# Altium project Isaac MSP430 Subsystem.PrjPcb
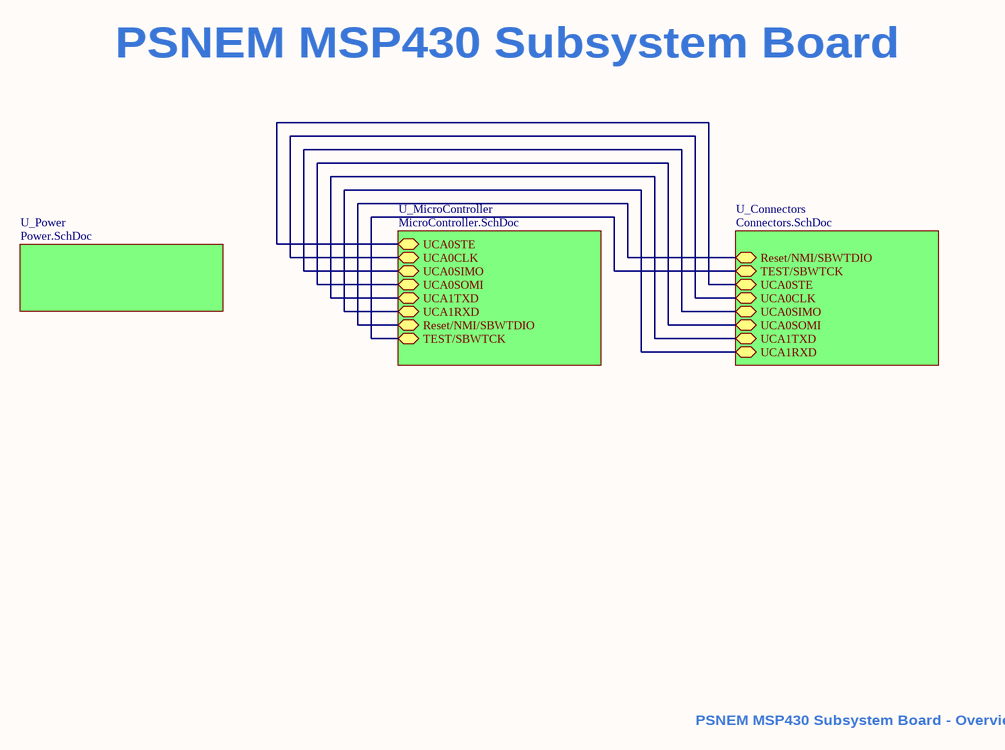
[diagram p0: Overview.SchDoc]
4 sheets, 36 parts. Net scope: hierarchical (ports join the sheet entries above them; power ports are global).
Board file: PSNEM-MCU-Subsystem.PcbDoc
Sheets:
  Overview.SchDoc
    U_Connectors = Connectors.SchDoc
    U_MicroController = MicroController.SchDoc
    U_Power = Power.SchDoc

## Sheet Overview.SchDoc
size A; SheetNumber: 1; SheetTotal: 4

### Sub-sheets
U_Connectors = Connectors.SchDoc: Reset/NMI/SBWTDIO (bidir), TEST/SBWTCK (bidir), UCA0STE (bidir), UCA0CLK (bidir), UCA0SIMO (bidir), UCA0SOMI (bidir), UCA1TXD (bidir), UCA1RXD (bidir)
U_MicroController = MicroController.SchDoc: UCA0STE (bidir), UCA0CLK (bidir), UCA0SIMO (bidir), UCA0SOMI (bidir), UCA1TXD (bidir), UCA1RXD (bidir), Reset/NMI/SBWTDIO (bidir), TEST/SBWTCK (bidir)
U_Power = Power.SchDoc: no entries

### Nets
NetC7_2: sheet U_Connectors/Reset/NMI/SBWTDIO, sheet U_MicroController/Reset/NMI/SBWTDIO
NetJ2_1: sheet U_Connectors/UCA0STE, sheet U_MicroController/UCA0STE
NetJ2_2: sheet U_Connectors/UCA0CLK, sheet U_MicroController/UCA0CLK
NetJ2_3: sheet U_Connectors/UCA0SIMO, sheet U_MicroController/UCA0SIMO
NetJ2_4: sheet U_Connectors/UCA0SOMI, sheet U_MicroController/UCA0SOMI
NetJ3_7: sheet U_Connectors/TEST/SBWTCK, sheet U_MicroController/TEST/SBWTCK
NetJ4_1: sheet U_Connectors/UCA1TXD, sheet U_MicroController/UCA1TXD
NetJ4_3: sheet U_Connectors/UCA1RXD, sheet U_MicroController/UCA1RXD

### Notes on the sheet
- PSNEM MSP430 Subsystem Board
- PSNEM MSP430 Subsystem Board - Overview

## Sheet Connectors.SchDoc
size A4; SheetNumber: 4; SheetTotal: 4
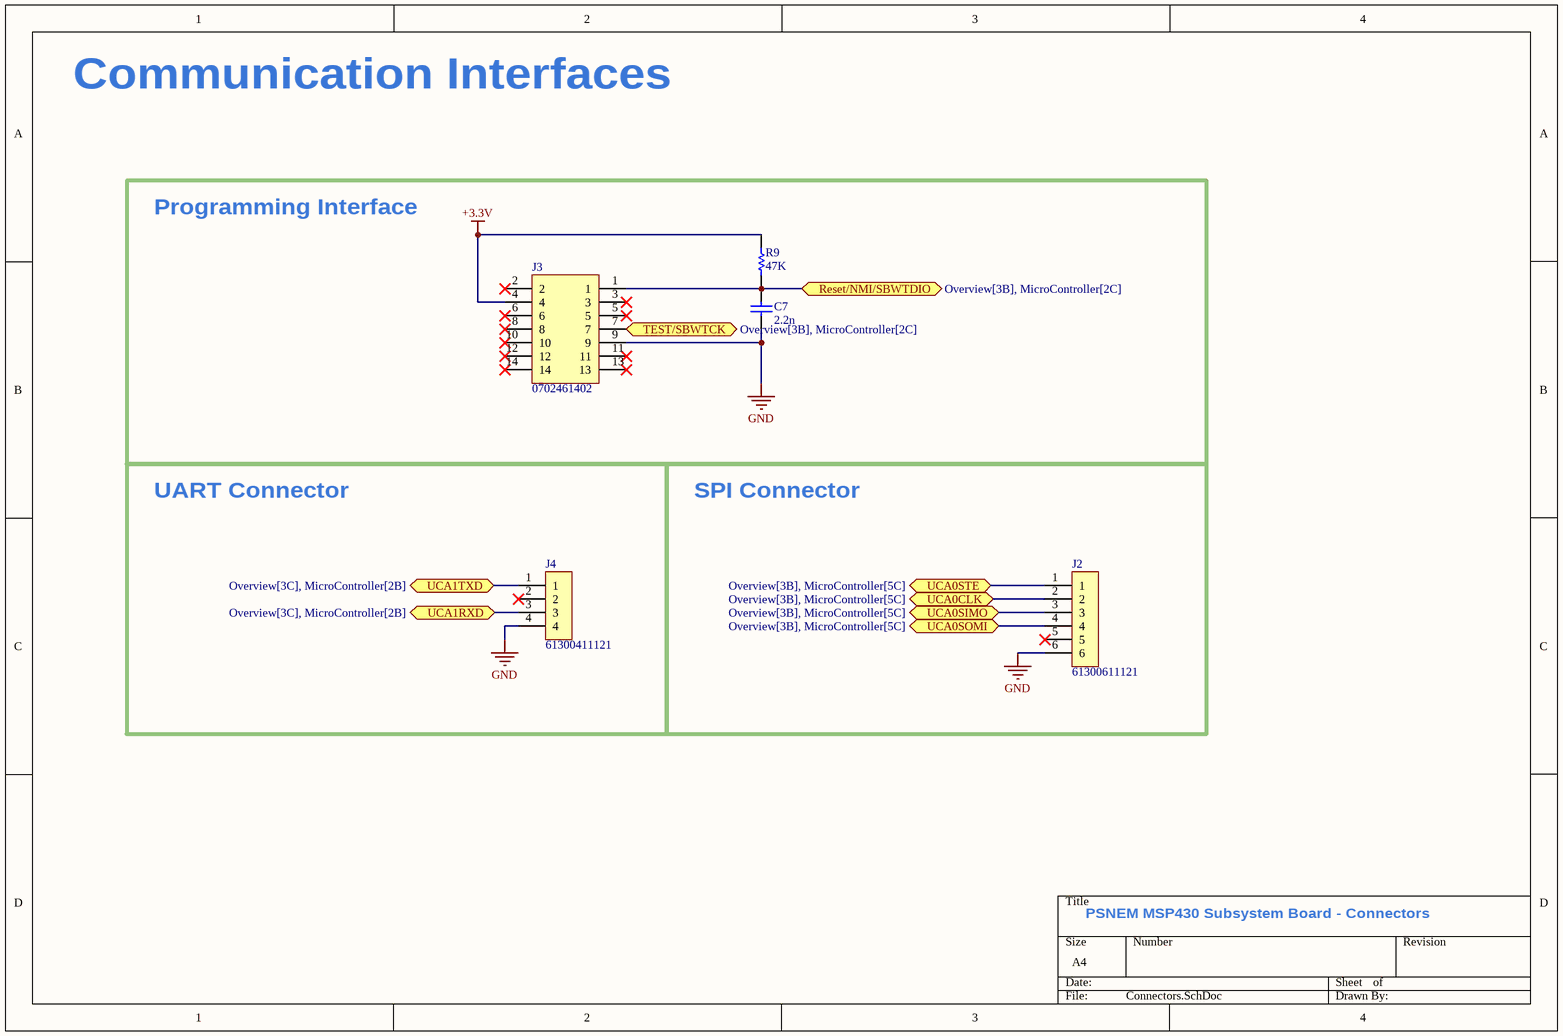
[diagram p1: Connectors.SchDoc]

### Parts
C7  2.2n  [0805 Cap]
J2  61300611121  [61300611121]
J3  0702461402  [0702461402]
J4  61300411121  [61300411121]
R9  47K  [RESC1608X06N]

### Blocks framed on the sheet
Programming Interface: C7 J3 R9
UART Connector: J4
SPI Connector: J2

### Ports
Reset/NMI/SBWTDIO (bidir, see Overview[3B], MicroController[2C]), TEST/SBWTCK (bidir, see Overview[3B], MicroController[2C]), UCA0CLK (bidir, see Overview[3B], MicroController[5C]), UCA0SIMO (bidir, see Overview[3B], MicroController[5C]), UCA0SOMI (bidir, see Overview[3B], MicroController[5C]), UCA0STE (bidir, see Overview[3B], MicroController[5C]), UCA1RXD (bidir, see Overview[3C], MicroController[2B]), UCA1TXD (bidir, see Overview[3C], MicroController[2B])

### Nets
+3.3V: J3.4 R9.2
GND: C7.1 J2.6 J3.9 J4.4
NetC7_2: C7.2 J3.1 R9.1 ; port Reset/NMI/SBWTDIO
NetJ2_1: J2.1 ; port UCA0STE
NetJ2_2: J2.2 ; port UCA0CLK
NetJ2_3: J2.3 ; port UCA0SIMO
NetJ2_4: J2.4 ; port UCA0SOMI
NetJ3_7: J3.7 ; port TEST/SBWTCK
NetJ4_1: J4.1 ; port UCA1TXD
NetJ4_3: J4.3 ; port UCA1RXD

Not connected (* = marked no-connect by the designer): J2 5*; J3 2* 3* 5* 6* 8* 10* 11* 12* 13* 14*; J4 2*

### Notes on the sheet
- Communication Interfaces
- PSNEM MSP430 Subsystem Board - Connectors

### Library data of the parts
C7 = CC0805KRX7R9BB222: 2200 pF ±10% 50V Ceramic Capacitor X7R 0805 (2012 Metric); value: 2.2n
J2 = 61300611121: CONN HEADER VERT 6POS 2.54MM
J3 = 0702461402: Connector Header Through Hole 14 position 0.100" (2.54mm)
J4 = 61300411121: Connector Header Through Hole 4 position 0.100" (2.54mm)
R9 = ERA-3VEB4702V: Thin Film Resistors - SMD 0603 0.1% 47Kohm 25ppm SMD; value: 47K

## Sheet MicroController.SchDoc
size A3; SheetNumber: 3; SheetTotal: 4
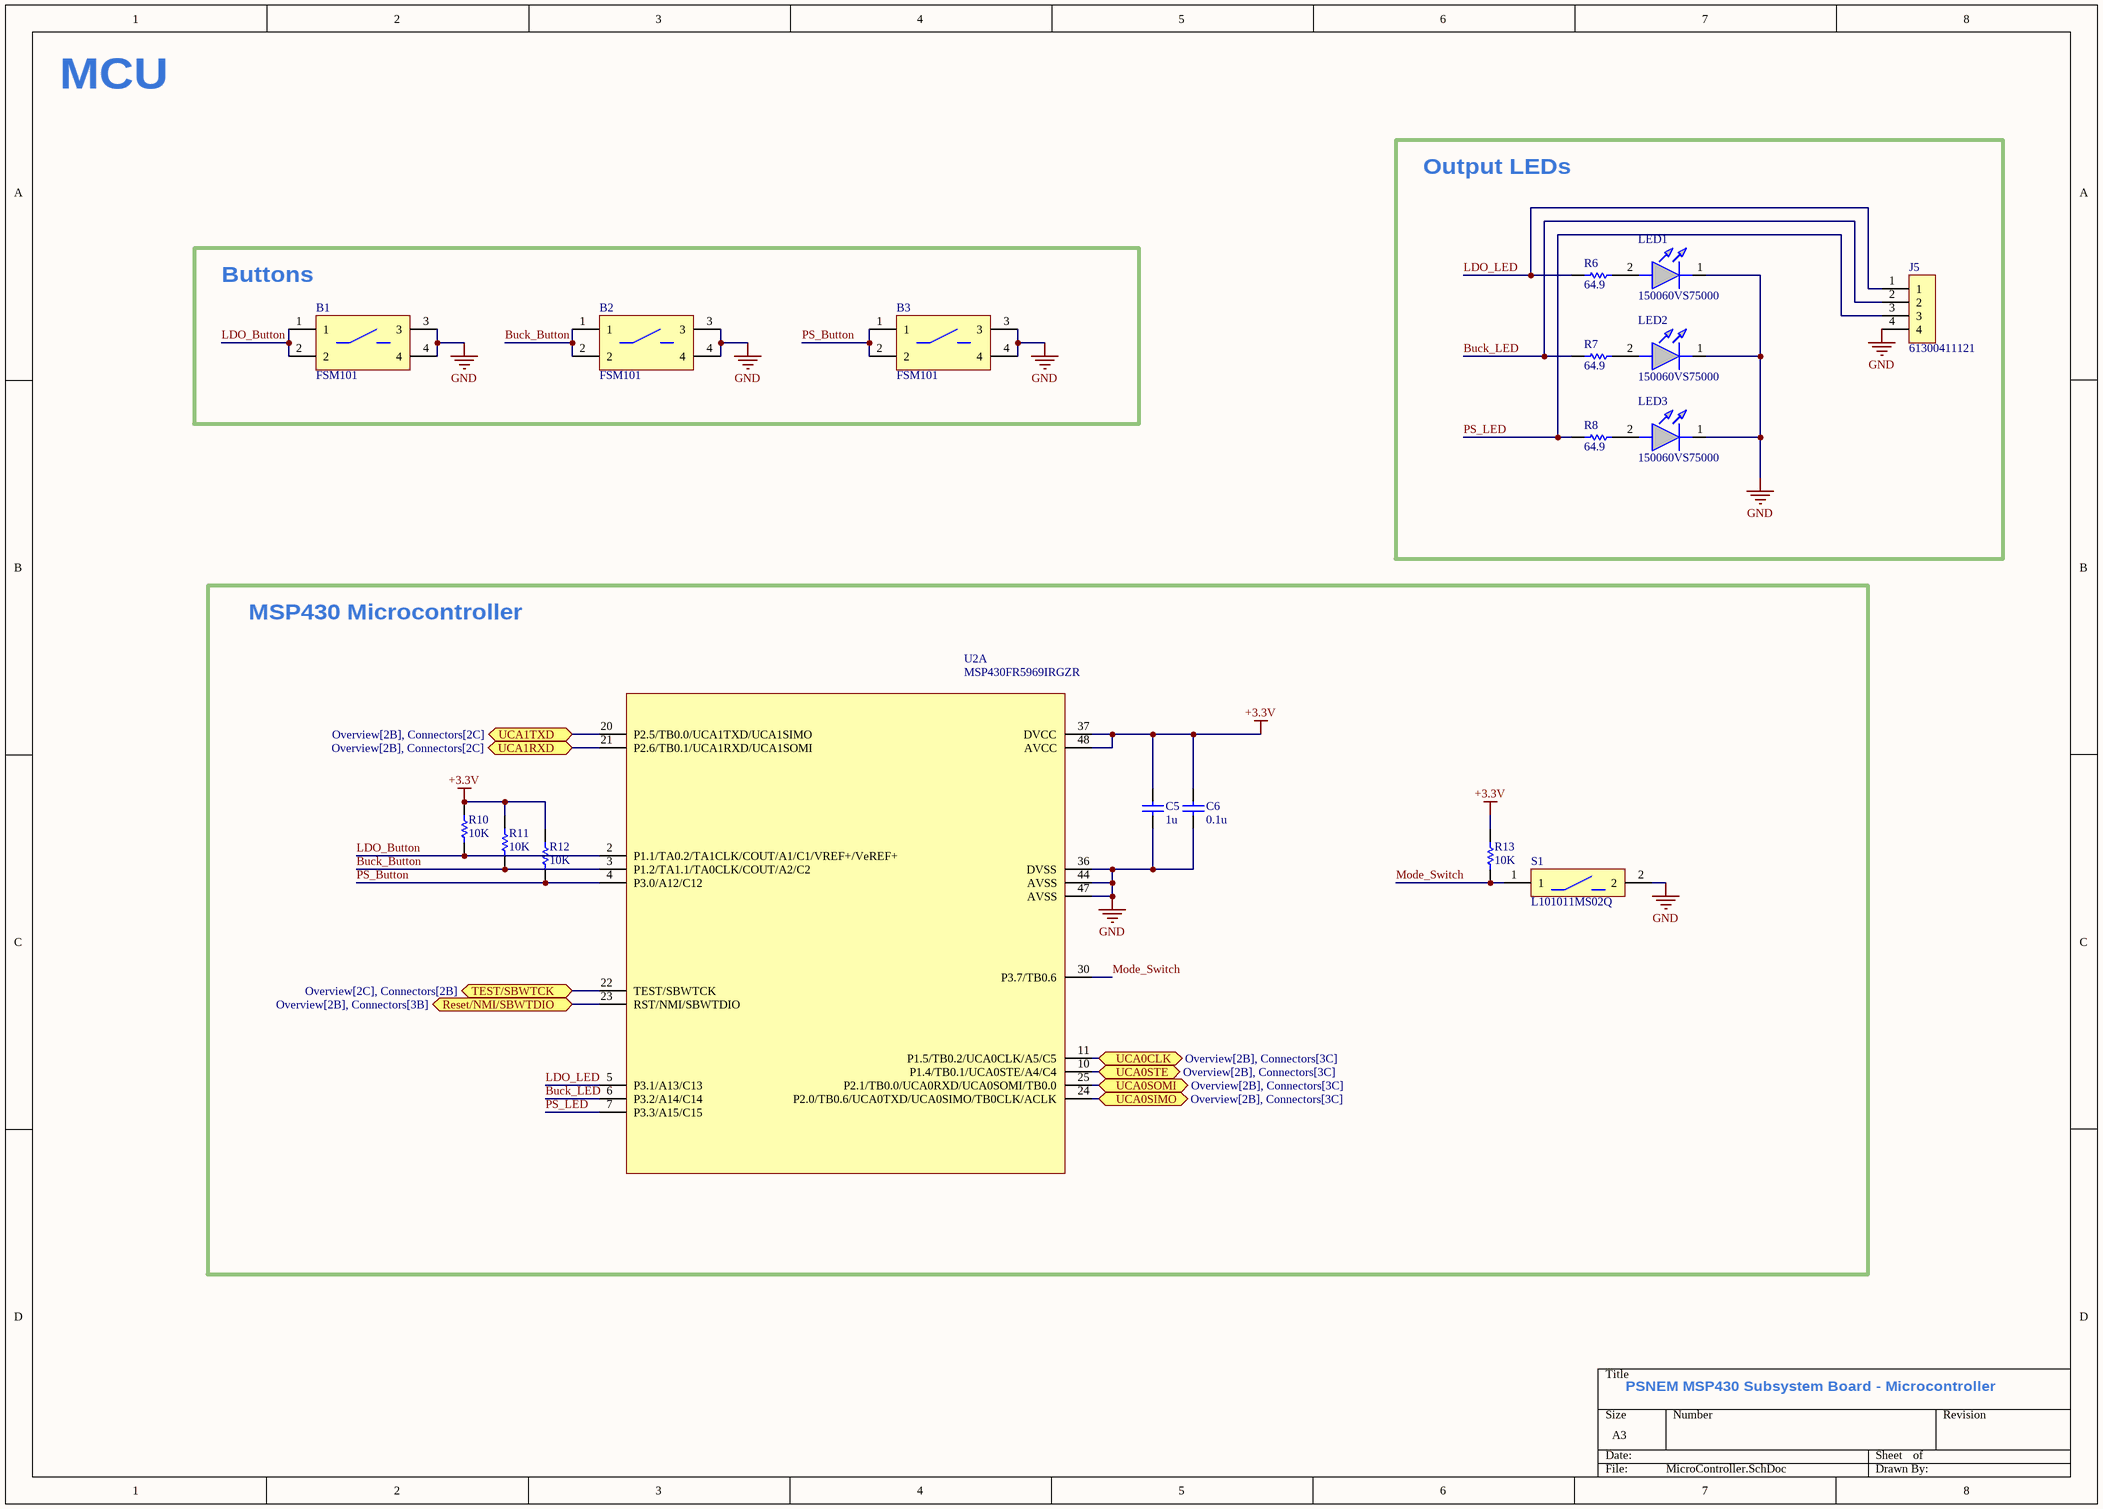
[diagram p2: MicroController.SchDoc]

### Parts
B1  FSM101  [FSM101]
B2  FSM101  [FSM101]
B3  FSM101  [FSM101]
C5  1u  [0805 Cap]
C6  0.1u  [0805 Cap]
J5  61300411121  [61300411121]
LED1  150060VS75000  [150060VS75000]
LED2  150060VS75000  [150060VS75000]
LED3  150060VS75000  [150060VS75000]
R6  64.9  [RESC1608X06N]
R7  64.9  [RESC1608X06N]
R8  64.9  [RESC1608X06N]
R10  10K  [RESC1608X06N]
R11  10K  [RESC1608X06N]
R12  10K  [RESC1608X06N]
R13  10K  [RESC1608X06N]
S1  L101011MS02Q  [L101011MS02Q]
U2  MSP430FR5969IRGZR  [MSP430FR5969IRGZR]  (part A of 2)

### Blocks framed on the sheet
Output LEDs: J5 LED1-LED3 R6-R8
Buttons: B1-B3
MSP430 Microcontroller: C5 C6 R10-R13 S1 U2

### Ports
Reset/NMI/SBWTDIO (bidir, see Overview[2B], Connectors[3B]), TEST/SBWTCK (bidir, see Overview[2C], Connectors[2B]), UCA0CLK (bidir, see Overview[2B], Connectors[3C]), UCA0SIMO (bidir, see Overview[2B], Connectors[3C]), UCA0SOMI (bidir, see Overview[2B], Connectors[3C]), UCA0STE (bidir, see Overview[2B], Connectors[3C]), UCA1RXD (bidir, see Overview[2B], Connectors[2C]), UCA1TXD (bidir, see Overview[2B], Connectors[2C])

### Nets
+3.3V: C5.2 C6.2 R10.2 R11.2 R12.2 R13.2 U2.37(DVCC) U2.48(AVCC)
GND: B1.3 B1.4 B2.3 B2.4 B3.3 B3.4 C5.1 C6.1 J5.4 LED1.1(K) LED2.1(K) LED3.1(K) S1.2 U2.36(DVSS) U2.44(AVSS) U2.47(AVSS)
Buck_Button: B2.1 B2.2 R11.1 U2.3(P1.2/TA1.1/TA0CLK/COUT/A2/C2)
Buck_LED: J5.2 R7.1 U2.6(P3.2/A14/C14)
LDO_Button: B1.1 B1.2 R10.1 U2.2(P1.1/TA0.2/TA1CLK/COUT/A1/C1/VREF+/VeREF+)
LDO_LED: J5.1 R6.1 U2.5(P3.1/A13/C13)
Mode_Switch: R13.1 S1.1 U2.30(P3.7/TB0.6)
PS_Button: B3.1 B3.2 R12.1 U2.4(P3.0/A12/C12)
PS_LED: J5.3 R8.1 U2.7(P3.3/A15/C15)
NetC7_2: U2.23(RST/NMI/SBWTDIO) ; port Reset/NMI/SBWTDIO
NetJ2_1: U2.10(P1.4/TB0.1/UCA0STE/A4/C4) ; port UCA0STE
NetJ2_2: U2.11(P1.5/TB0.2/UCA0CLK/A5/C5) ; port UCA0CLK
NetJ2_3: U2.24(P2.0/TB0.6/UCA0TXD/UCA0SIMO/TB0CLK/ACLK) ; port UCA0SIMO
NetJ2_4: U2.25(P2.1/TB0.0/UCA0RXD/UCA0SOMI/TB0.0) ; port UCA0SOMI
NetJ3_7: U2.22(TEST/SBWTCK) ; port TEST/SBWTCK
NetJ4_1: U2.20(P2.5/TB0.0/UCA1TXD/UCA1SIMO) ; port UCA1TXD
NetJ4_3: U2.21(P2.6/TB0.1/UCA1RXD/UCA1SOMI) ; port UCA1RXD
NetLED1_2: LED1.2(A) R6.2
NetLED2_2: LED2.2(A) R7.2
NetLED3_2: LED3.2(A) R8.2

### Notes on the sheet
- MCU
- PSNEM MSP430 Subsystem Board - Microcontroller

### Library data of the parts
B1-B3 = FSM101: Tactile Switch SPST-NO Top Actuated Through Hole
C5 = CC0805KKX7R7BB105: 1 µF ±10% 16V Ceramic Capacitor X7R 0805 (2012 Metric); value: 1u
C6 = CC0805KRX7R9BB104: 0.1 µF ±10% 50V Ceramic Capacitor X7R 0805 (2012 Metric); value: 0.1u
J5 = 61300411121: as J4 on sheet Connectors
LED1-LED3 = 150060VS75000: LED GREEN CLEAR 0603 SMD
R6-R8 = ERA-3AEB64R9V: Thin Film Resistors - SMD 0603 64.9ohm 0.1% 25ppm; value: 64.9
R10-R13 = CRCW060310K0FKEAHP: RES SMD 10K OHM 1% 1/3W 0603; value: 10K
S1 = L101011MS02Q: SWITCH SLIDE SPST 4A 125V
U2 = MSP430FR5969IRGZR: MSP430 CPUXV2 MSP430™ FRAM Microcontroller IC 16-Bit 16MHz 64KB (64K x 8) FRAM 48-VQFN (7x7)

## Sheet Power.SchDoc
size A4; SheetNumber: 2; SheetTotal: 4
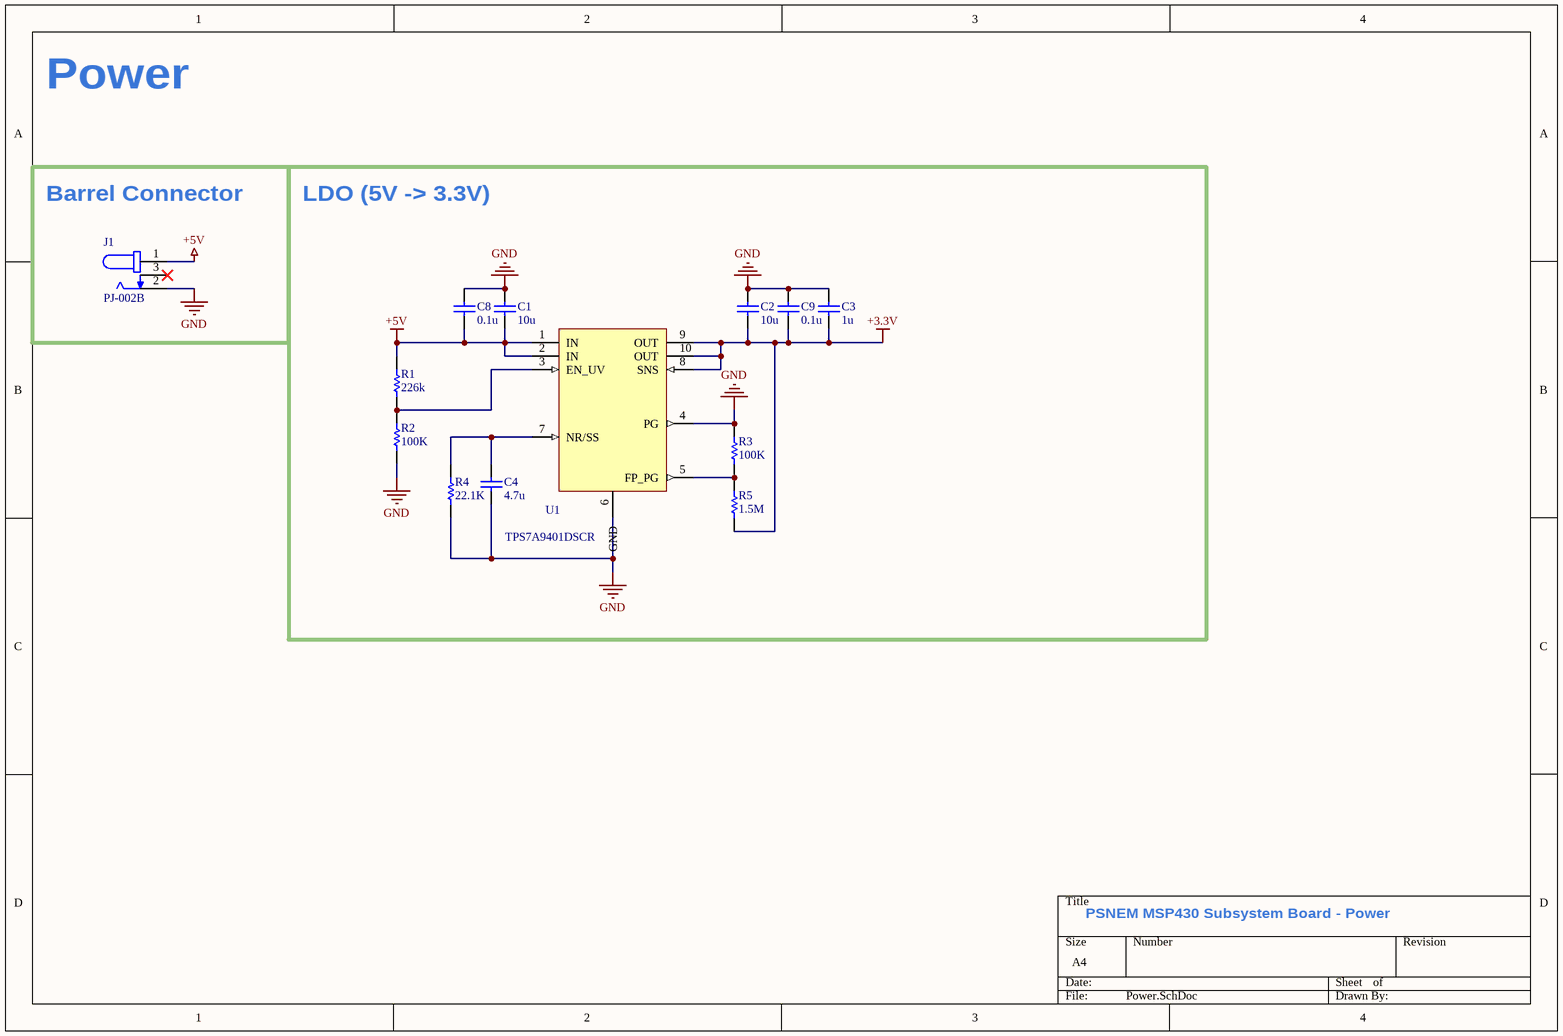
[diagram p3: Power.SchDoc]

### Parts
C1  10u  [0805 Cap]
C2  10u  [0805 Cap]
C3  1u  [0805 Cap]
C4  4.7u  [0805 Cap]
C8  0.1u  [0805 Cap]
C9  0.1u  [0805 Cap]
J1  PJ-002B  [PJ-002B]
R1  226k  [RESC1608X06N]
R2  100K  [RESC1608X06N]
R3  100K  [RESC1608X06N]
R4  22.1K  [RESC1608X06N]
R5  1.5M  [RESC1608X06N]
U1  TPS7A9401DSCR  [TPS7A9401DSCR]

### Blocks framed on the sheet
Barrel Connector: J1
LDO (5V -> 3.3V): C1-C4 C8 C9 R1-R5 U1

### Nets
+3.3V: C2.1 C3.2 C9.1 R5.1 U1.8(SNS) U1.9(OUT) U1.10(OUT)
+5V: C1.1 C8.2 J1.1 R1.2 U1.1(IN) U1.2(IN)
GND: C1.2 C2.2 C3.1 C4.1 C8.1 C9.2 J1.2 R2.1 R3.2 R4.1 U1.4(PG)
NetC4_2: C4.2 R4.2 U1.7(NR/SS)
NetR1_1: R1.1 R2.2 U1.3(EN_UV)
NetR3_1: R3.1 R5.2 U1.5(FP_PG)

Not connected (* = marked no-connect by the designer): J1 3*; U1 6(GND)

### Notes on the sheet
- Power
- PSNEM MSP430 Subsystem Board - Power

### Library data of the parts
C1 C2 = CL21B106KPQNNNE: 10 µF ±10% 10V Ceramic Capacitor X7R 0805 (2012 Metric); value: 10u
C3 = CC0805KKX7R7BB105: as C5 on sheet MicroController; value: 1u
C4 = CL21B475KOFNFNE: 4.7 µF ±10% 16V Ceramic Capacitor X7R 0805 (2012 Metric); value: 4.7u
C8 C9 = CC0805KRX7R9BB104: as C6 on sheet MicroController; value: 0.1u
J1 = PJ-002B: Power Barrel Connector Jack 2.50mm ID (0.098"), 5.50mm OD (0.217") Through Hole, Right Angle
R1 = RN73H1JTTD2263B25: Thin Film Resistors - SMD 226kOhm,0603,0.1%,25; value: 226k
R2 R3 = ERA-3VRW1003V: Thin Film Resistors - SMD 0603 0.05% 100Kohm 10ppm SMD; value: 100K
R4 = TNPW060322K1BEEA: Thin Film Resistors - SMD 22.1Kohms .1% 25ppm; value: 22.1K
R5 = MCT0603MD1504BP500: Thin Film Resistors - SMD .125W 1.5Mohms .1% 0603 25ppm; value: 1.5M
U1 = TPS7A9401DSCR: Linear Voltage Regulator IC Positive Adjustable 1 Output 1A 10-WSON (3x3); Manufacturer: Texas Instruments; Manufacturer PN: TPS7A9401DSCR

## Nets that join several sheets
+3.3V: Connectors (J3.4 R9.2), MicroController (8 pins), Power (7 pins)
GND: Connectors (C7.1 J2.6 J3.9 J4.4), MicroController (16 pins), Power (11 pins)
NetC7_2: Connectors (C7.2 J3.1 R9.1), MicroController (U2.23)
NetJ2_1: Connectors (J2.1), MicroController (U2.10)
NetJ2_2: Connectors (J2.2), MicroController (U2.11)
NetJ2_3: Connectors (J2.3), MicroController (U2.24)
NetJ2_4: Connectors (J2.4), MicroController (U2.25)
NetJ3_7: Connectors (J3.7), MicroController (U2.22)
NetJ4_1: Connectors (J4.1), MicroController (U2.20)
NetJ4_3: Connectors (J4.3), MicroController (U2.21)